# EAGLE design TurntableStrobeModule (EAGLE 6.4)
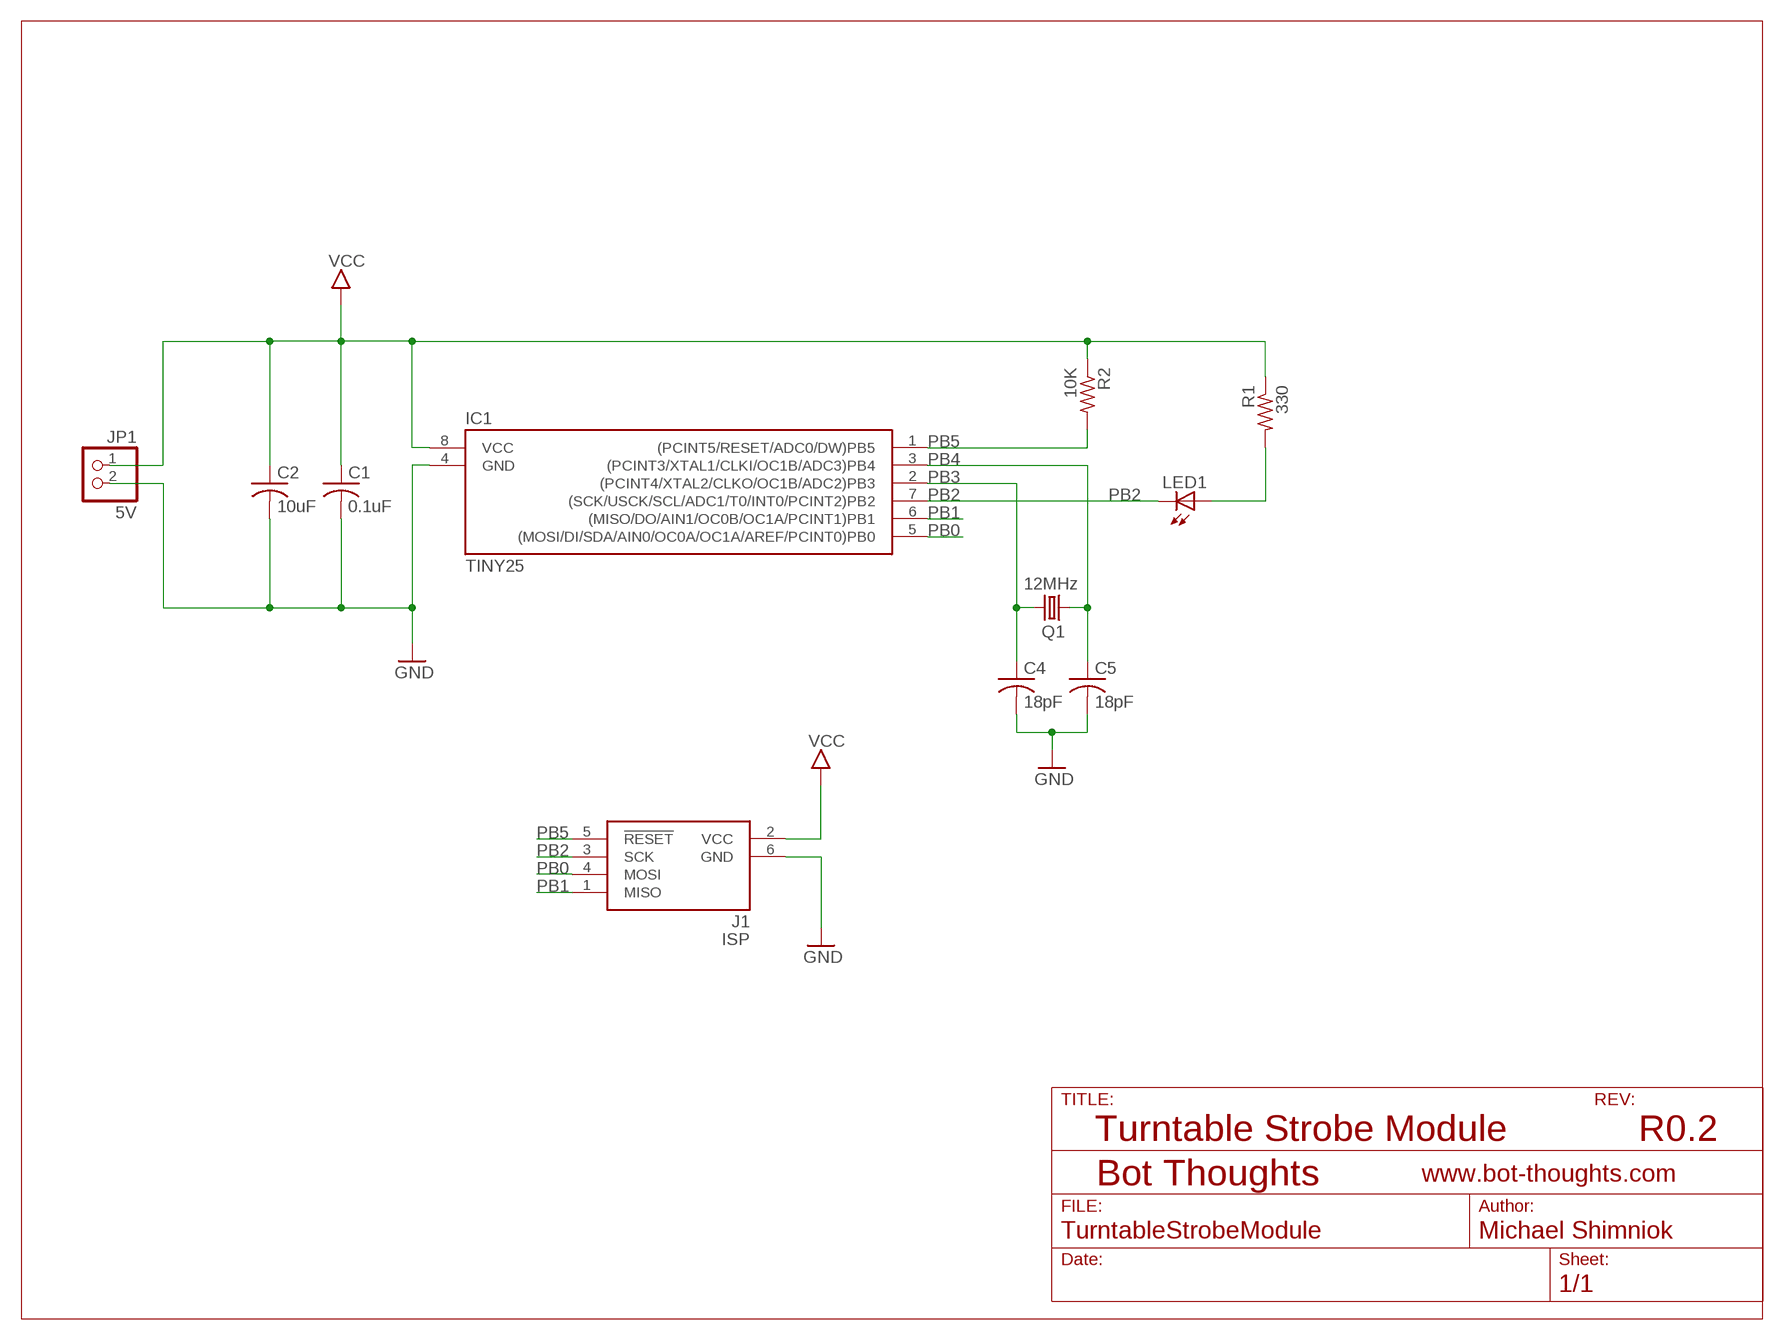
[diagram p0: schematic, sheet 1]

## Parts
C1  0.1uF  C-USC0603  [C0603]
C2  10uF  C-USC1206  [C1206]
C4  18pF  C-USC0603  [C0603]
C5  18pF  C-USC0603  [C0603]
IC1  TINY25  TINY25/45/85-20SSU  [SOIC8N]
J1  ISP  AVRISP6_COMPACT  [CON6P2R]
JP1  5V  PINHD-1X02_2.54-S  [1X02-S]
LED1  LED5MMRA  [LED5MMRA]
Q1  12MHz  CRYSTALNDK5X3  [NDK_2PAD_5X3]
R1  330  R-US_R0603  [R0603]
R2  10K  R-US_R0603  [R0603]

## Nets
GND: C1.2 C2.2 C4.2 C5.2 IC1.4(GND) J1.6(GND) JP1.2
N$3: LED1.A R1.2
PB0: IC1.5((MOSI/DI/SDA/AIN0/OC0A/OC1A/AREF/PCINT0)PB0) J1.4(MOSI)
PB1: IC1.6((MISO/DO/AIN1/OC0B/OC1A/PCINT1)PB1) J1.1(MISO)
PB2: IC1.7((SCK/USCK/SCL/ADC1/T0/INT0/PCINT2)PB2) J1.3(SCK) LED1.C
PB3: C4.1 IC1.2((PCINT4/XTAL2/CLKO/OC1B/ADC2)PB3) Q1.P$2
PB4: C5.1 IC1.3((PCINT3/XTAL1/CLKI/OC1B/ADC3)PB4) Q1.P$1
PB5: IC1.1((PCINT5/RESET/ADC0/DW)PB5) J1.5(!RESET) R2.2
VCC: C1.1 C2.1 IC1.8(VCC) J1.2(VCC) JP1.1 R1.1 R2.1

## Notes on the sheet
- Turntable Strobe Module | R0.2

## Library data of the parts
C1 C2 C4 C5 = rcl:C-US: CAPACITOR, American symbol
IC1 = bt_avr:TINY25/45/85: Atmel AVR ATiny25,45,85 8-bit Microcontroller
J1 = bt_avr:AVRISP6: 6-pin dual-row connector for Atmel AVRISP programmer interface
JP1 = pinhead-2:PINHD-1X02: PIN HEADER
LED1 = bt_opto:LED: LED Various packages
Q1 = bt_crystal:CRYSTAL: CRYSTAL
R1 R2 = rcl:R-US_: RESISTOR, American symbol

## Board
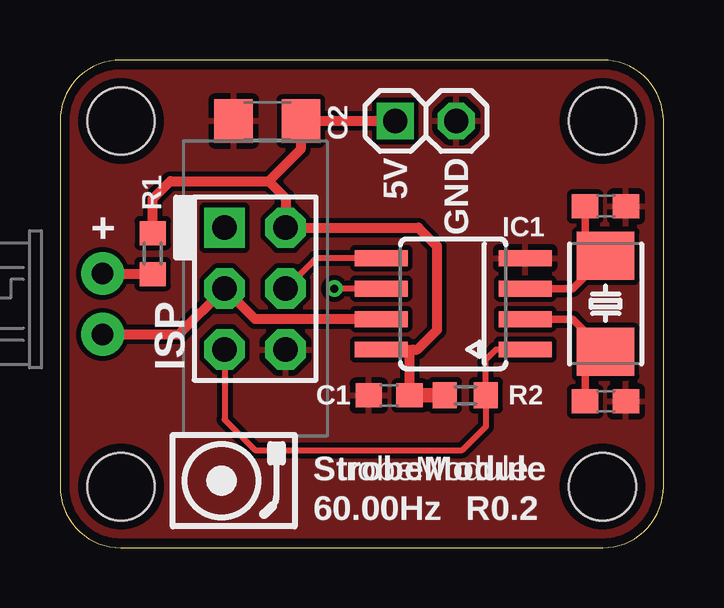
[diagram p1: board, top side]
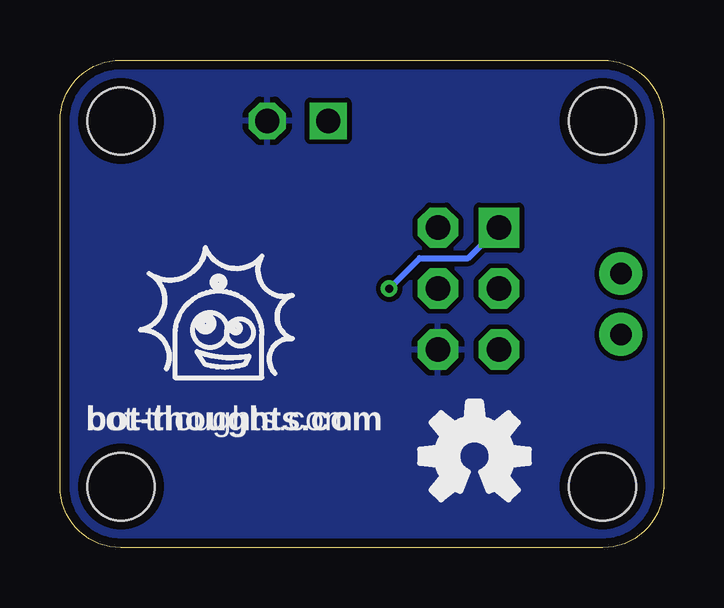
[diagram p2: board, bottom side, seen from below]

Size 25.15 x 20.32 mm. Coordinates in mm from the lower left corner, seen from the top.
Outline: 25.15,2.54 25.15,17.78 arc90 22.61,20.32 2.54,20.32 arc90 0,17.78 0,2.54 arc90 2.54,0 22.61,0 arc90 25.15,2.54
Copper layers (1*16): Top 0.0356mm / dielectric 1.5011mm / Bottom 0.0356mm
Design rules "default *": minimum track width 6mil, minimum drill 13mil, track to track 6mil, track to pad 6mil, pad to pad 6mil, via to via 6mil, smd to smd 6mil, copper to edge 15mil, drill to drill 6mil, minimum pad ring 7mil, minimum via ring 7mil, stop-mask expansion 4mil, vias tented up to drill 20mil, thermal gap 10mil
Holes 2.8 mm at 2.54,2.54 2.54,17.78 22.61,17.78 22.61,2.54

### Footprints (pad centres in the part's own frame; a part is rotated, then mirrored left to right if it is on the bottom)
C0603 = smd 1.1 x 1: 1 -0.85,0; 2 0.85,0
C1206 = smd 1.6 x 1.8: 1 -1.4,0; 2 1.4,0
SOIC8N = smd 0.66 x 2.2: 1 -1.905,-3; 2 -0.635,-3; 3 0.635,-3; 4 1.905,-3; 5 1.905,3; 6 0.635,3; 7 -0.635,3; 8 -1.905,3
CON6P2R = drill 1.016 pad 1.676 square: 1 -2.54,-1.27 | drill 1.016 pad 1.676 octagon: 2 -2.54,1.27; 3 0,-1.27; 4 0,1.27; 5 2.54,-1.27; 6 2.54,1.27
1X02-S = drill 1.016 square: 1 -1.27,0 | drill 1.016 octagon: 2 1.27,0
LED5MMRA = drill 0.9 pad 1.778: A 0,1.27; C 0,-1.27
NDK_2PAD_5X3 = smd 2 x 2.4: P$1 -2,0; P$2 2,0
R0603 = smd 1 x 1.1: 1 -0.85,0; 2 0.85,0

### Placement (x,y rotation side)
C1  13.72,6.35 180 top
C2  8.64,17.78 180 top
C4  22.73,6.1 0 top
C5  22.73,14.22 0 top
IC1  16.38,10.16 90 top
J1  8.13,10.79 270 top
JP1  15.24,17.78 0 top
LED1  1.78,10.16 0 top
Q1  22.73,10.16 270 top
R1  3.86,12.25 270 top
R2  16.89,6.35 0 top

### Tracks (layer width: path | path; a pad name or v marks a point on that pad's centre or on a via)
GND
  pour Top (isolate 0.203): 2.54,0 22.61,0 arc90 25.15,2.54 25.15,17.78 arc90 22.61,20.32 2.54,20.32 arc90 0,17.78 0,2.54 arc90
  pour Bottom (isolate 0.203): 2.54,0 22.61,0 arc90 25.15,2.54 25.15,17.78 arc90 22.61,20.32 2.54,20.32 arc90 0,17.78 0,2.54 arc90
N$3
  Top 0.406: R1.2 1.8,11.4 LED1.A
PB0
  Top 0.254: IC1.5 10.67,12.06 J1.4
PB1  (via drill 0.33)
  Top 0.254: IC1.6 v11.43,10.79
  Bottom 0.254: v11.43,10.79 10.16,12.06 8.13,12.06 J1.1
PB2
  Top 0.406: LED1.C 4.95,8.89 J1.3 8.13,9.53 IC1.7
PB3
  Top 0.305: IC1.2 21.37,9.53 Q1.P$2 23.1,8.53 23.1,8.67 21.88,7.45 C4.1
PB4
  Top 0.305: C5.1 21.88,13.01 Q1.P$1 21.37,10.79 IC1.3
PB5
  Top 0.254: J1.5 6.86,5.33 8.13,4.06 16.76,4.06 17.74,5.04 R2.2 17.74,7.83 18.16,8.26 IC1.1
VCC
  Top 0.406: R1.1 3.86,14.53 4.6,15.27 8.7,15.27 | 8.7,15.27 9.4,14.57 9.4,13.46 J1.2 14.94,13.34 15.7,12.57 15.7,9.07 14.88,8.26 14.7,8.26 | 8.7,15.27 10.03,16.6 C2.1 JP1.1 | IC1.8 14.7,8.26 | C1.1 14.57,8.12 14.7,8.26
  Top 0.61: R2.1 C1.1

### Text on the board
tNames: GND | StrobeModule | 60.00Hz | R0.2
bNames: bot-thoughts.com
tsilk: C2 | 5V | GND | R1 | + | IC1 | ISP | C1 | R2 | StrobeModule | 60.00Hz | R0.2
bsilk: bot-thoughts.com